# EAGLE design funklicht (EAGLE 6.5.0)
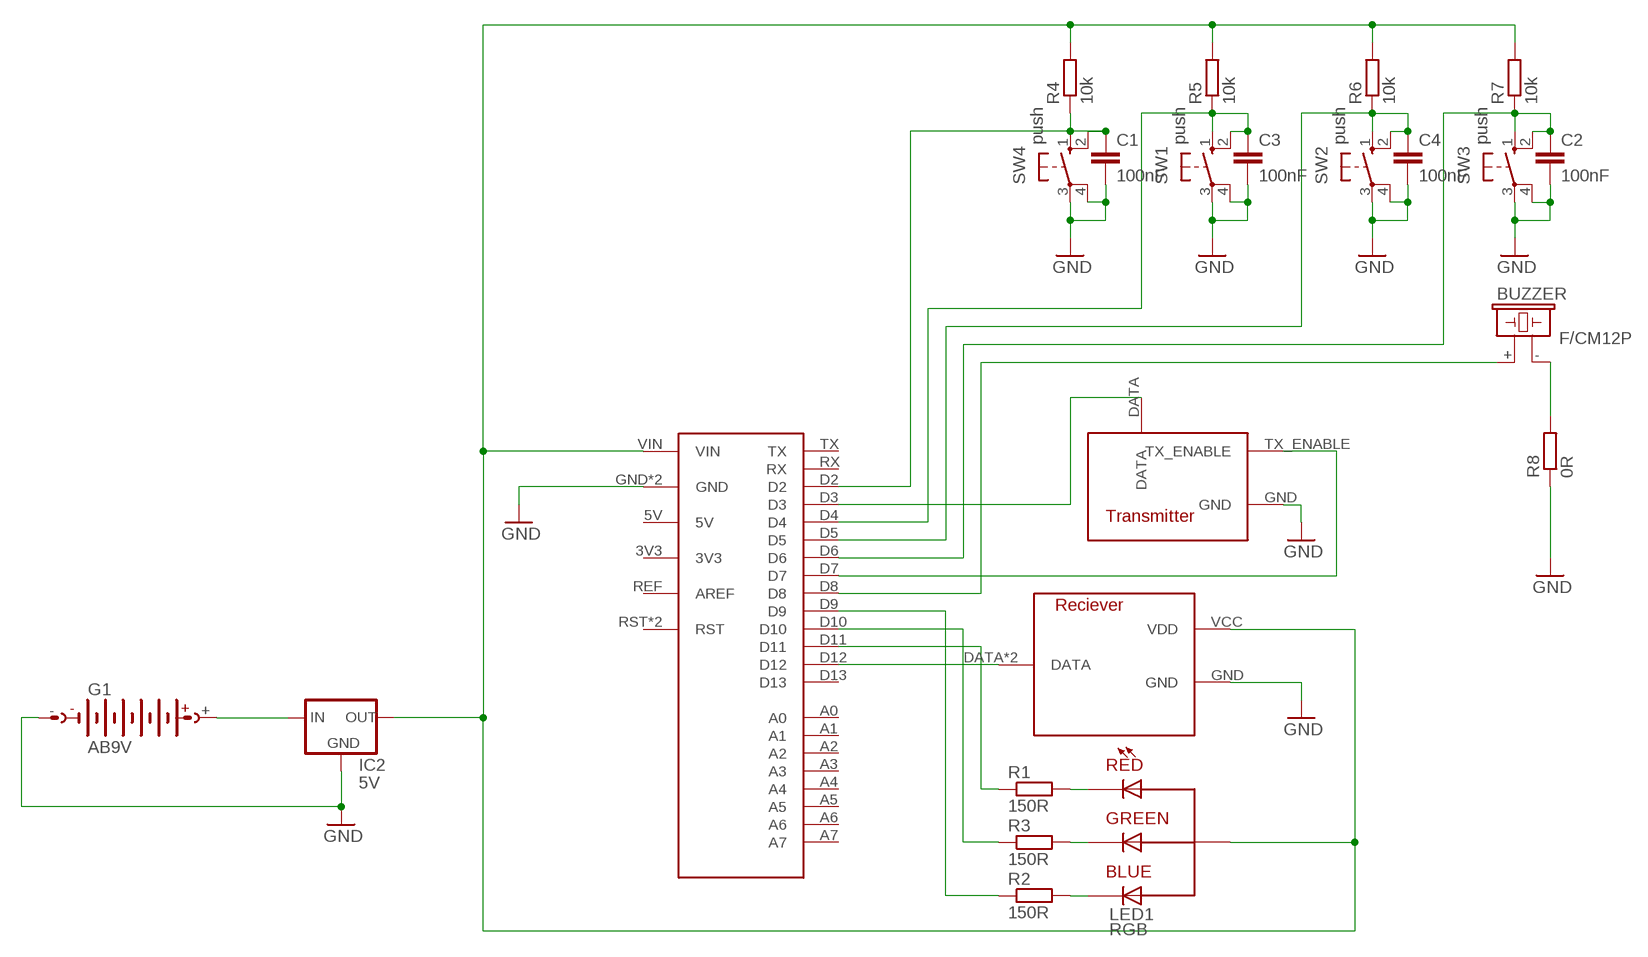
[diagram p0: schematic, sheet 1]

## Parts
BUZZER  F/CM12P  [F/CM12P]
C1  100nF  C-EU050-025X075  [C050-025X075]
C2  100nF  C-EU050-025X075  [C050-025X075]
C3  100nF  C-EU050-025X075  [C050-025X075]
C4  100nF  C-EU050-025X075  [C050-025X075]
G1  AB9V  [AB9V]
IC2  5V  78XXS  [78XXS]
LED1  RGB  LED5MM  [LED5MM]
R1  150R  R-EU_0207/10  [0207/10]
R2  150R  R-EU_0207/10  [0207/10]
R3  150R  R-EU_0207/10  [0207/10]
R4  10k  R-EU_0207/10  [0207/10]
R5  10k  R-EU_0207/10  [0207/10]
R6  10k  R-EU_0207/10  [0207/10]
R7  10k  R-EU_0207/10  [0207/10]
R8  0R  R-EU_0207/10  [0207/10]
SW1  push  10-XX  [B3F-10XX]
SW2  push  10-XX  [B3F-10XX]
SW3  push  10-XX  [B3F-10XX]
SW4  push  10-XX  [B3F-10XX]
U$1  ARDUINO_PLATINE  [ARDUINO_PLATINE]
U$2  RECIEVER  [RECIEVER]
U$3  TRANSMITTER  [TRANSMITTER]

## Nets
BLUE: LED1.BLUE R2.2
GND: C1.2 C2.2 C3.2 C4.2 G1.- IC2.GND R8.1 SW1.3(P) SW1.4(P1) SW2.3(P) SW2.4(P1) SW3.3(P) SW3.4(P1) SW4.3(P) SW4.4(P1) U$1.GND U$1.GND1(GND) U$2.GND U$3.GND
GREEN: LED1.GREEN R3.2
N$1: C1.1 R4.1 SW4.1(S) SW4.2(S1) U$1.D2
N$2: U$1.D3 U$3.DATA
N$3: U$1.D12 U$2.DATA U$2.DATA1(DATA)
N$4: R1.1 U$1.D11
N$5: R3.1 U$1.D10
N$6: R2.1 U$1.D9
N$15: C3.1 R5.1 SW1.1(S) SW1.2(S1) U$1.D4
N$16: C4.1 R6.1 SW2.1(S) SW2.2(S1) U$1.D5
N$17: C2.1 R7.1 SW3.1(S) SW3.2(S1) U$1.D6
N$18: BUZZER.+ U$1.D8
N$19: BUZZER.- R8.2
N$20: G1.+ IC2.IN
RED: LED1.RED R1.2
TX_ENABLE: U$1.D7 U$3.TX_ENABLE
VDD: IC2.OUT LED1.VCC R4.2 R5.2 R6.2 R7.2 U$1.VIN U$2.VCC(VDD)
Unconnected: U$1.3V3 U$1.5V U$1.A0 U$1.A1 U$1.A2 U$1.A3 U$1.A4 U$1.A5 U$1.A6 U$1.A7 U$1.D13 U$1.REF(AREF) U$1.RST U$1.RST1(RST) U$1.RX U$1.TX

## Library data of the parts
BUZZER = buzzer:F/CM12P: BUZZER Source: Buerklin; OC_FARNELL: unknown; OC_NEWARK: unknown
C1-C4 = rcl:C-EU: CAPACITOR, European symbol
G1 = battery:AB9V: 9-V BATTERY CLIP
IC2 = v-reg:78XXS: VOLTAGE REGULATOR
LED1 = RGB LED:LED: LED OSRAM: - CHIPLED LG R971, LG N971, LY N971, LG Q971, LY Q971, LO R971, LY R971 LH N974, LH R974 LS Q976, LO Q976, LY Q976 LO Q996 - Hyper CHIPLED LW Q18S LB Q993, LB Q99A, LB R99A - SideLED LS A670, LO A670, LY A670, LG A670, LP A670 LB A673, LV A673, LT A673, LW A673 LH A674 LY A675 LS A676, LA A676, LO A676, LY A676, LW A676 LS A679, LY A679, LG A679 - Hyper Micro SIDELED® LS Y876, LA Y876, LO Y876, LY Y876 LT Y87S - SmartLED LW L88C, LW L88S LB L89C, LB L89S, LG L890 LS L89K, LO L89K, LY L89K LS L896, LA L896, LO L896, LY L896 - TOPLED LS T670, LO T670, LY T670, LG T670, LP T670 LSG T670, LSP T670, LSY T670, LOP T670, LYG T670 LG T671, LOG T671, LSG T671 LB T673, LV T673, LT T673, LW T673 LH T674 LS T676, LA T676, LO T676, LY T676, LB T676, LH T676, LSB T676, LW T676 LB T67C, LV T67C, LT T67C, LS T67K, LO T67K, LY T67K, LW E67C LS E67B, LA E67B, LO E67B, LY E67B, LB E67C, LV E67C, LT E67C LW T67C LS T679, LY T679, LG T679 LS T770, LO T770, LY T770, LG T770, LP T770 LB T773, LV T773, LT T773, LW T773 LH T774 LS E675, LA E675, LY E675, LS T675 LS T776, LA T776, LO T776, LY T776, LB T776 LHGB T686 LT T68C, LB T68C - Hyper Mini TOPLED® LB M676 - Mini TOPLED Santana® LG M470 LS M47K, LO M47K, LY M47K Source: http://www.osram.convergy.de LUXEON: - LUMILED® LXK2-PW12-R00, LXK2-PW12-S00, LXK2-PW14-U00, LXK2-PW14-V00 LXK2-PM12-R00, LXK2-PM12-S00, LXK2-PM14-U00 LXK2-PE12-Q00, LXK2-PE12-R00, LXK2-PE12-S00, LXK2-PE14-T00, LXK2-PE14-U00 LXK2-PB12-K00, LXK2-PB12-L00, LXK2-PB12-M00, LXK2-PB14-N00, LXK2-PB14-P00, LXK2-PB14-Q00 LXK2-PR12-L00, LXK2-PR12-M00, LXK2-PR14-Q00, LXK2-PR14-R00 LXK2-PD12-Q00, LXK2-PD12-R00, LXK2-PD12-S00 LXK2-PH12-R00, LXK2-PH12-S00 LXK2-PL12-P00, LXK2-PL12-Q00, LXK2-PL12-R00 Source: www.luxeon.com KINGBRIGHT: KA-3528ASYC Source: www.kingbright.com
R1-R8 = rcl:R-EU_: RESISTOR, European symbol
SW1-SW4 = buttons:10-XX: OMRON SWITCH
U$1 = arduino_platine:ARDUINO_PLATINE
U$2 = funkmodule:RECIEVER
U$3 = funkmodule:TRANSMITTER

## Board
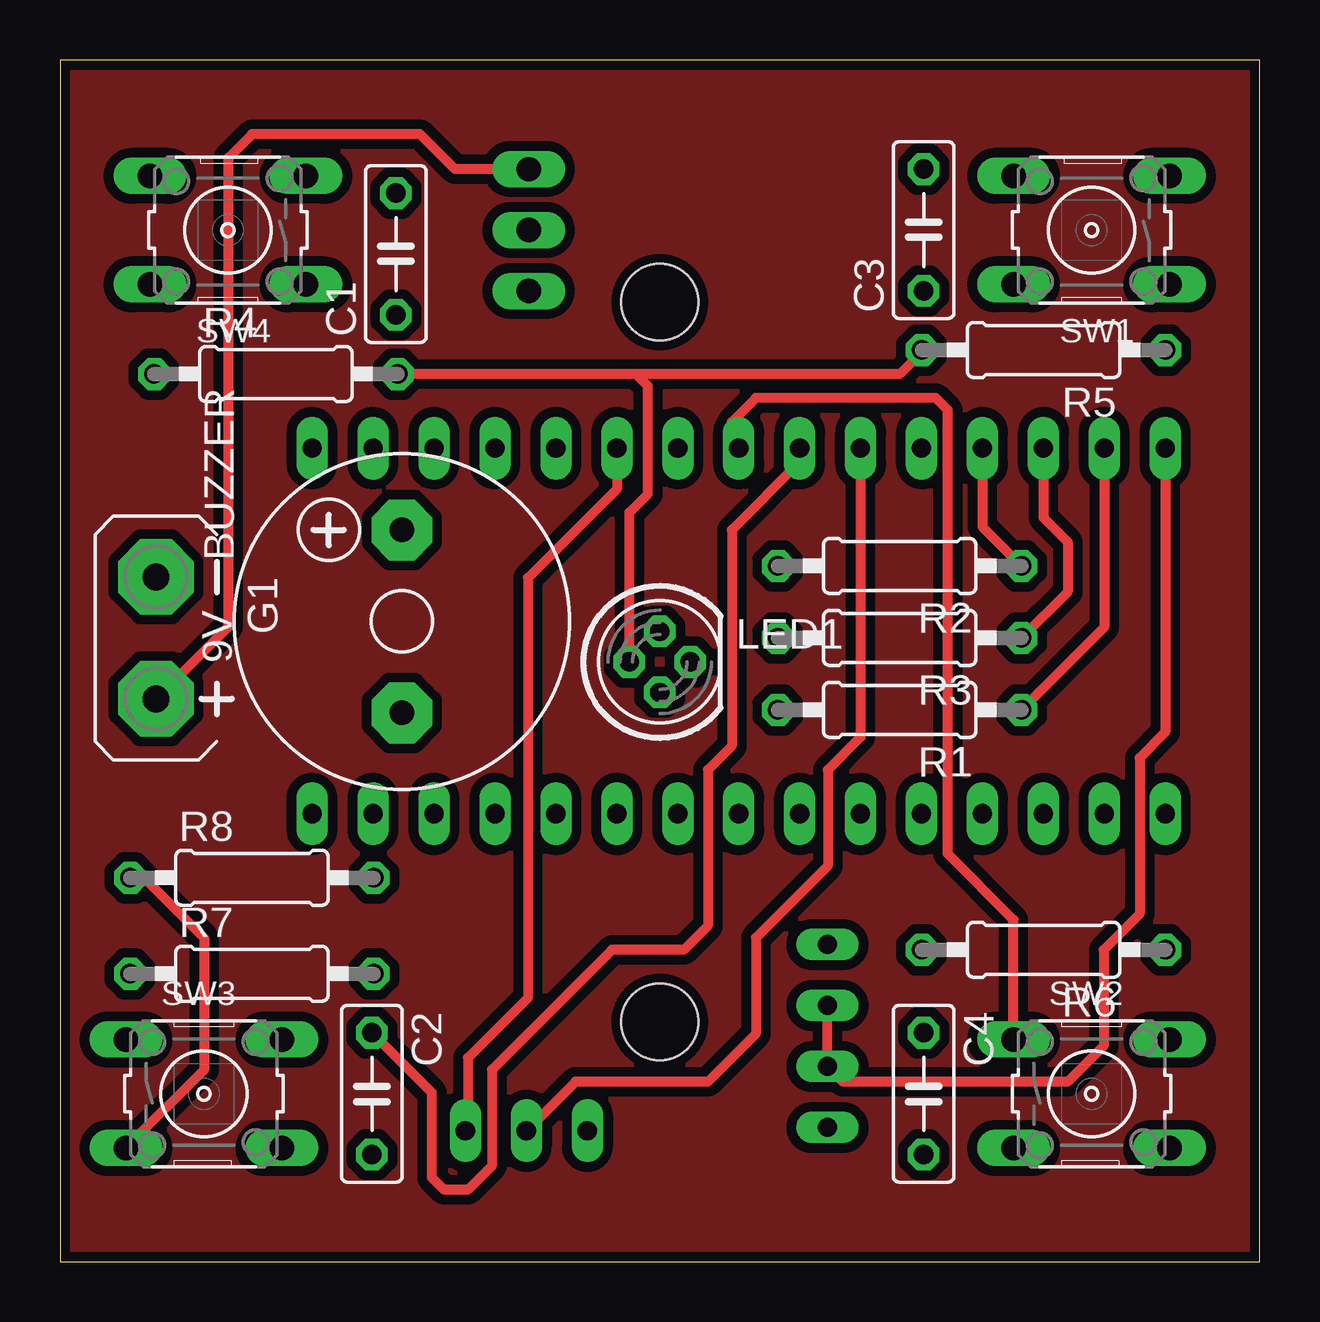
[diagram p1: board, top side]
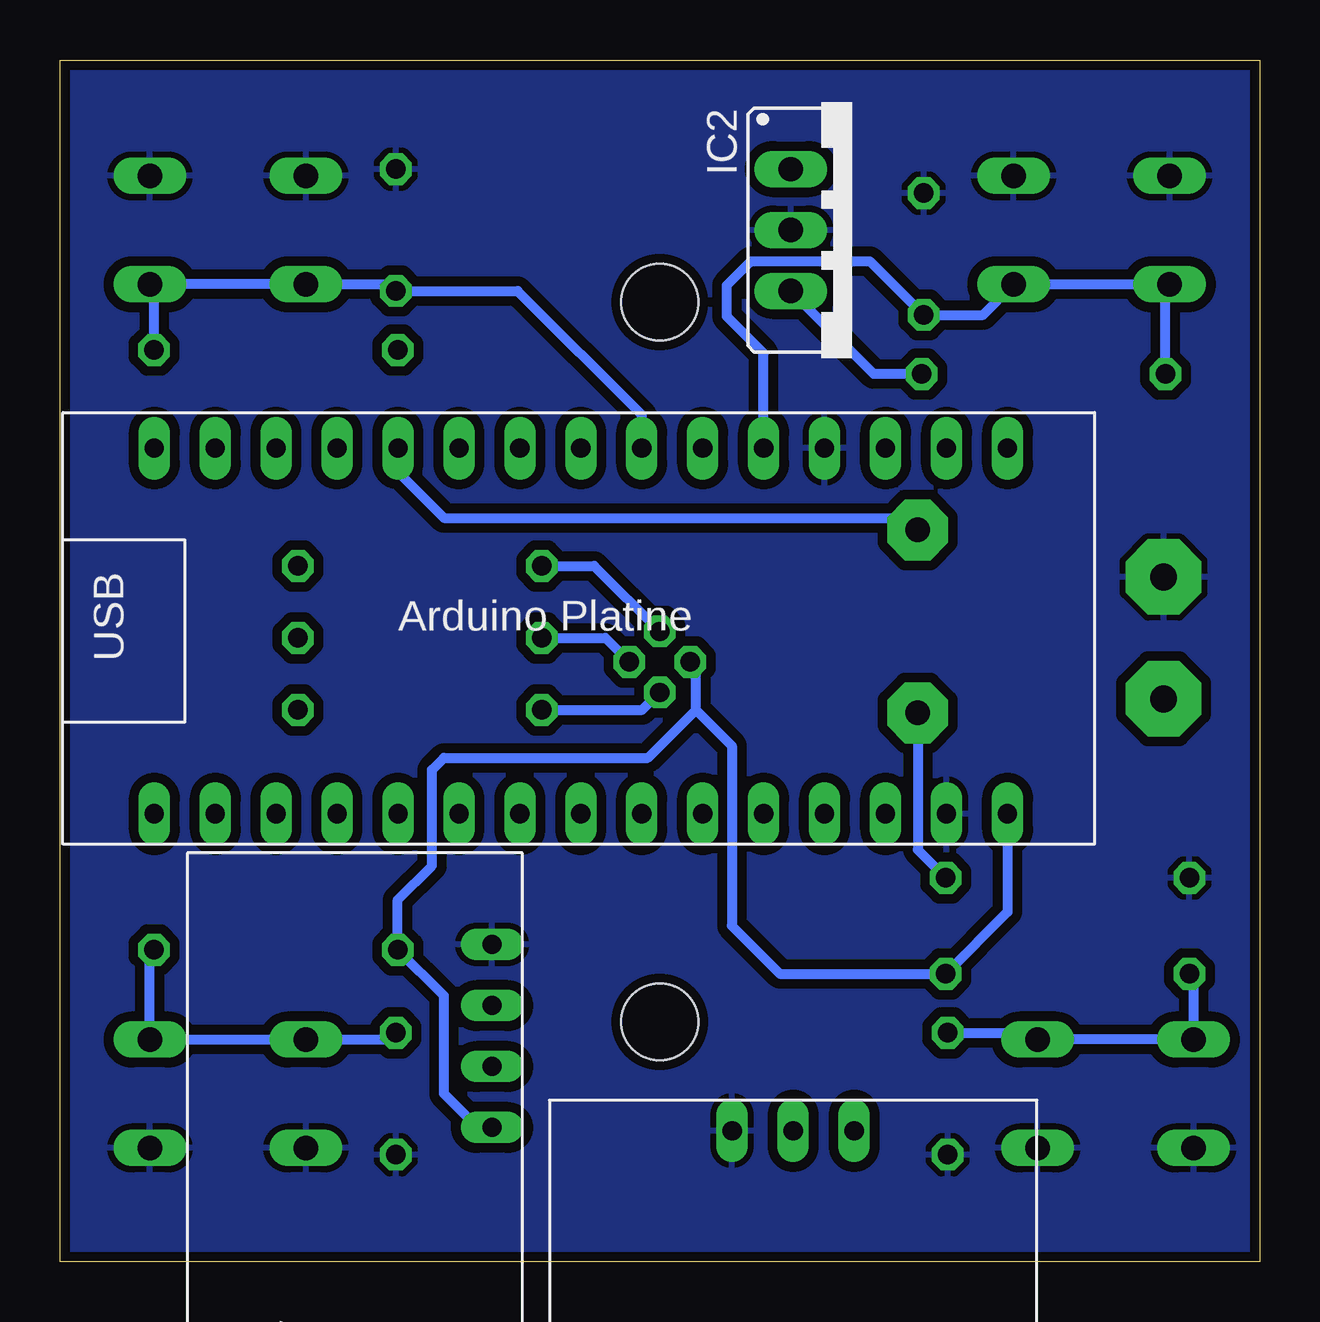
[diagram p2: board, bottom side, seen from below]

Size 50 x 50.09 mm. Coordinates in mm from the lower left corner, seen from the top.
Outline: 0,0 50,0 50,50.09 0,50.09 0,0
Copper layers (1*16): Top 0.035mm / dielectric 1.5mm / Bottom 0.035mm
Design rules "ITead_rule": minimum track width 6mil, minimum drill 12mil, track to track 6mil, track to pad 6mil, pad to pad 6mil, via to via 6mil, smd to smd 0mil, copper to edge 10mil, drill to drill 10mil, minimum pad ring 10mil, minimum via ring 6mil, stop-mask expansion 2mil, vias tented up to drill 100mil, thermal gap 10mil
Holes 3.2 mm at 25,10 25,40

### Footprints (pad centres in the part's own frame; a part is rotated, then mirrored left to right if it is on the bottom)
F/CM12P = drill 1.016 pad 2.54 octagon: + 3.81,0; - -3.81,0
C050-025X075 = drill 0.813 octagon: 1 -2.54,0; 2 2.54,0
AB9V = drill 1.118 pad 3.15 octagon: + 0,2.54; - 0,-2.54
78XXS = drill 1.016 long: GND 0,-2.54; IN -2.54,-2.54; OUT 2.54,-2.54
LED5MM = drill 0.8 octagon: BLUE 0,1.27; RED 0,-1.27 | drill 0.813 octagon: GREEN 1.27,0; VCC -1.27,0
0207/10 = drill 0.813 octagon: 1 -5.08,0; 2 5.08,0
B3F-10XX = drill 1.016 long: 1 -3.251,2.261; 2 3.251,2.261; 3 -3.251,-2.261; 4 3.251,-2.261
ARDUINO_PLATINE = drill 0.8 long: 3V3 6.35,1.27; 5V 31.75,1.27; A0 11.43,1.27; A1 13.97,1.27; A2 16.51,1.27; A3 19.05,1.27; A4 21.59,1.27; A5 24.13,1.27; A6 26.67,1.27; A7 29.21,1.27; D2 29.21,16.51; D3 26.67,16.51; D4 24.13,16.51; D5 21.59,16.51; D6 19.05,16.51; D7 16.51,16.51; D8 13.97,16.51; D9 11.43,16.51; D10 8.89,16.51; D11 6.35,16.51; D12 3.81,16.51; D13 3.81,1.27; GND 36.83,1.27; GND1 31.75,16.51; REF 8.89,1.27; RST 34.29,1.27; RST1 34.29,16.51; RX 36.83,16.51; TX 39.37,16.51; VIN 39.37,1.27
RECIEVER = drill 0.8 long: DATA 24.13,1.27; DATA1 21.59,1.27; GND 26.67,1.27; VCC 19.05,1.27
TRANSMITTER = drill 0.8 long: DATA 7.62,1.27; GND 12.7,1.27; TX_ENABLE 10.16,1.27

### Placement (x,y rotation side)
BUZZER  14.25,26.69 90 top
C1  14,42 90 top
C2  13,7 270 top
C3  36,43 90 top
C4  36,7 270 top
G1  4,26 180 top
IC2  17,43 270 bottom
LED1  25,25 0 top
R1  35,23 180 top
R2  35,29 180 top
R3  35,26 180 top
R4  9,37 0 top
R5  41,38 180 top
R6  41,13 180 top
R7  8,12 0 top
R8  8,16 0 top
SW1  43,43 180 top
SW2  43,7 0 top
SW3  6,7 0 top
SW4  7,43 180 top
U$1  49.88,17.4 0 bottom
U$2  30.72,-13.45 90 bottom
U$3  9.28,6.73 180 bottom

### Tracks (layer width: path | path; a pad name or v marks a point on that pad's centre or on a via)
BLUE
  Bottom 0.406: R2.2 27.73,29 LED1.BLUE
GND
  Top 0.406: R8.1 3.5,16 6,13.5 6,7.99 SW3.3
  Bottom 0.406: G1.- 4,28.5
  pour Bottom (isolate 0.406): 0,50 50,50 50,0 0,0
GREEN
  Bottom 0.406: R3.2 27.27,26 LED1.GREEN
N$1
  Bottom 0.406: R4.1 3.92,40.57 SW4.2 SW4.1 11.53,39.46 C1.1 16.24,41.7 21.2,41.7 22.2,40.7 22.2,39.4 20.67,37.87 U$1.D2
N$2
  Top 0.406: U$1.D3 23.21,32.21 19.5,28.5 19.5,11 17,8.5 17,5.56 U$3.DATA
N$3
  Top 0.406: U$1.D12 46.07,22.07 45,21 45,14.5 43.5,13 43.5,9 42,7.5 32.63,7.5 U$2.DATA1 U$2.DATA
N$4
  Top 0.406: U$1.D11 43.53,26.45 R1.1
N$5
  Top 0.406: U$1.D10 40.99,31.01 42,30 42,27.92 R3.1
N$6
  Top 0.406: U$1.D9 38.45,30.63 R2.1
N$7
  pour Top (isolate 0.406): 0,50 50,50 50,0 0,0
N$15
  Bottom 0.406: U$1.D4 25.75,35.29 30.92,40.46 C3.1 36.28,40.74 SW1.2 SW1.1 46.08,40.57 R5.1
N$16
  Top 0.406: SW2.1 39.75,14.25 37,17 37,35.5 36.5,36 29,36 28,35 28,34.2 U$1.D5
  Bottom 0.406: R6.1 46.25,12.83 SW2.2 SW2.1 36.28,9.26 C4.1
N$17
  Top 0.406: U$1.D6 30.83,33.33 28,30.5 28,21.5 27,20.5 27,14 26,13 23,13 18,8 18,4 17,3 16,3 15.5,3.5 15.5,7.04 C2.1
  Bottom 0.406: C2.1 9.53,9.54 SW3.2 SW3.1 2.75,11.83 R7.1
N$18
  Bottom 0.406: U$1.D8 35.91,32.91 34,31 14.75,31 BUZZER.+
N$19
  Bottom 0.406: BUZZER.- 14.25,17.17 R8.2
N$20
  Top 0.406: IC2.IN 16.46,45.54 15,47 8,47 7,46 7,26.46 G1.+
RED
  Bottom 0.406: R1.2 25.73,23 LED1.RED
TX_ENABLE
  Top 0.406: U$1.D7 33.37,21.87 32,20.5 32,16.5 29,13.5 29,9.5 27,7.5 21.48,7.5 U$3.TX_ENABLE
VDD
  Top 0.406: R5.2 35.92,37.92 35,37 24,37 | 24,37 R4.2 | LED1.VCC 23.73,31.23 24.5,32 24.5,36.5 24,37
  Bottom 0.406: R4.2 16.08,37 IC2.OUT | U$2.VCC 32.6,5.6 34,7 34,11.08 R6.2 35.92,15.08 34.5,16.5 34.5,20.5 34,21 25.5,21 23.5,23 | 23.5,23 23.5,24.77 LED1.VCC | U$1.VIN 10.51,14.57 R7.2 20,12 22,14 22,21.5 23.5,23